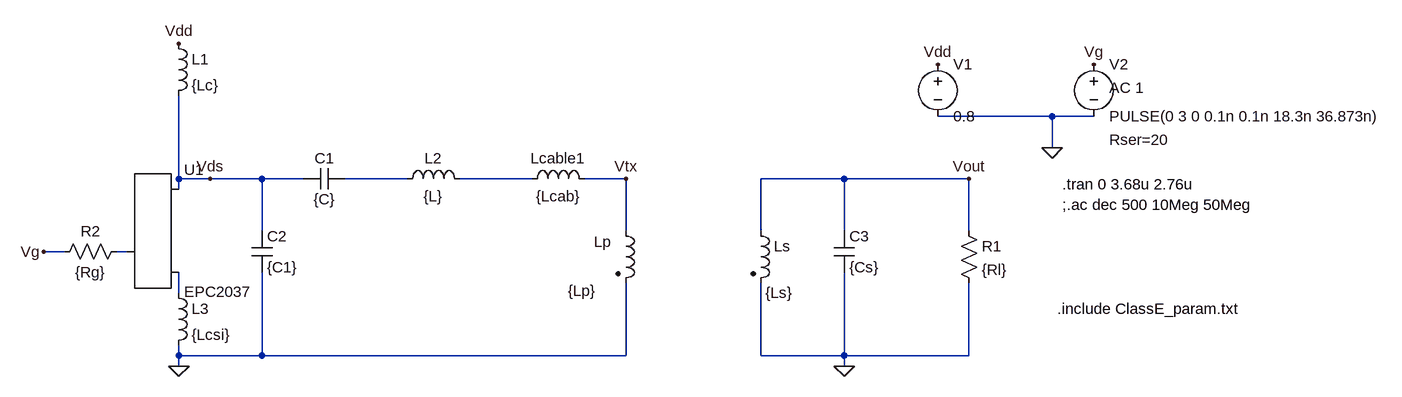
[diagram p0: schematic Draft2.asc]
Draft2.asc, the LTspice schematic file:
Version 4
SHEET 1 1828 680
WIRE 1168 -32 992 -32
WIRE 1232 -32 1168 -32
WIRE 1168 16 1168 -32
WIRE -176 64 -176 -64
WIRE -128 64 -176 64
WIRE -48 64 -128 64
WIRE 16 64 -48 64
WIRE 176 64 80 64
WIRE 368 64 256 64
WIRE 512 64 448 64
WIRE 848 64 720 64
WIRE 1040 64 848 64
WIRE -176 80 -176 64
WIRE -48 144 -48 64
WIRE 512 144 512 64
WIRE 720 144 720 64
WIRE 848 144 848 64
WIRE 1040 144 1040 64
WIRE -352 176 -384 176
WIRE -256 176 -272 176
WIRE -176 240 -176 208
WIRE -176 336 -176 320
WIRE -48 336 -48 208
WIRE -48 336 -176 336
WIRE 512 336 512 224
WIRE 512 336 -48 336
WIRE 720 336 720 224
WIRE 848 336 848 208
WIRE 848 336 720 336
WIRE 1040 336 1040 224
WIRE 1040 336 848 336
WIRE -176 352 -176 336
WIRE 848 352 848 336
FLAG 1168 16 0
FLAG 1232 -112 Vg
FLAG -176 -144 Vdd
FLAG -384 176 Vg
FLAG 512 64 Vtx
FLAG -176 352 0
FLAG 848 352 0
FLAG 1040 64 Vout
FLAG -128 64 Vds
FLAG 992 -112 Vdd
SYMBOL voltage 1232 -128 R0
WINDOW 123 24 52 Left 2
WINDOW 39 24 132 Left 2
SYMATTR Value2 AC 1
SYMATTR SpiceLine Rser=20
SYMATTR InstName V2
SYMATTR Value PULSE(0 3 0 0.1n 0.1n 18.3n 36.873n)
SYMBOL EPCGaN -256 176 R0
SYMATTR InstName U1
SYMATTR Value EPC2037
SYMBOL ind -192 -160 R0
SYMATTR InstName L1
SYMATTR Value {Lc}
SYMATTR SpiceLine Rser=0.1
SYMBOL ind 160 80 R270
WINDOW 0 32 56 VTop 2
WINDOW 3 5 56 VBottom 2
SYMATTR InstName L2
SYMATTR Value {L}
SYMATTR SpiceLine Rser=0.1
SYMBOL cap 80 48 R90
WINDOW 0 0 32 VBottom 2
WINDOW 3 32 32 VTop 2
SYMATTR InstName C1
SYMATTR Value {C}
SYMATTR SpiceLine Rser=0.1
SYMBOL res 1024 128 R0
SYMATTR InstName R1
SYMATTR Value {Rl}
SYMBOL cap -64 144 R0
SYMATTR InstName C2
SYMATTR Value {C1}
SYMATTR SpiceLine Rser=0.1
SYMBOL res -256 160 R90
WINDOW 0 0 56 VBottom 2
WINDOW 3 32 56 VTop 2
SYMATTR InstName R2
SYMATTR Value {Rg}
SYMBOL ind2 496 128 R0
WINDOW 0 -33 33 Left 2
WINDOW 3 -73 108 Left 2
SYMATTR InstName Lp
SYMATTR Value {Lp}
SYMATTR Type ind
SYMATTR SpiceLine Rser={Rp}
SYMBOL ind2 704 128 R0
WINDOW 3 23 111 Left 2
SYMATTR Value {Ls}
SYMATTR InstName Ls
SYMATTR Type ind
SYMATTR SpiceLine Rser={Rs}
SYMBOL cap 832 144 R0
SYMATTR InstName C3
SYMATTR Value {Cs}
SYMBOL ind -192 224 R0
SYMATTR InstName L3
SYMATTR Value {Lcsi}
SYMATTR SpiceLine Rser=0.1
SYMBOL voltage 992 -128 R0
WINDOW 123 0 0 Left 0
WINDOW 39 0 0 Left 0
SYMATTR InstName V1
SYMATTR Value 0.8
SYMBOL ind 352 80 R270
WINDOW 0 32 56 VTop 2
WINDOW 3 5 56 VBottom 2
SYMATTR InstName Lcable1
SYMATTR Value {Lcab}
SYMATTR SpiceLine Rser={Rcab}
TEXT 1176 264 Left 2 !.include ClassE_param.txt
TEXT 1184 72 Left 2 !.tran 0 3.68u 2.76u
TEXT 1184 104 Left 2 !;.ac dec 500 10Meg 50Meg

The netlist it stands for:
* Draft2.asc
V2 Vg 0 PULSE(0 3 0 0.1n 0.1n 18.3n 36.873n) AC 1 Rser=20
XU1 N003 Vds N004 EPC2037
L1 Vdd Vds {Lc} Rser=0.1
L2 N001 N002 {L} Rser=0.1
C1 N001 Vds {C} Rser=0.1
R1 Vout 0 {Rl}
C2 Vds 0 {C1} Rser=0.1
R2 N003 Vg {Rg}
Lp Vtx 0 {Lp} Rser={Rp}
Ls Vout 0 {Ls} Rser={Rs}
C3 Vout 0 {Cs}
L3 N004 0 {Lcsi} Rser=0.1
V1 Vdd 0 0.8
Lcable1 N002 Vtx {Lcab} Rser={Rcab}
.include ClassE_param.txt
.tran 0 3.68u 2.76u
;.ac dec 500 10Meg 50Meg
.backanno
.end